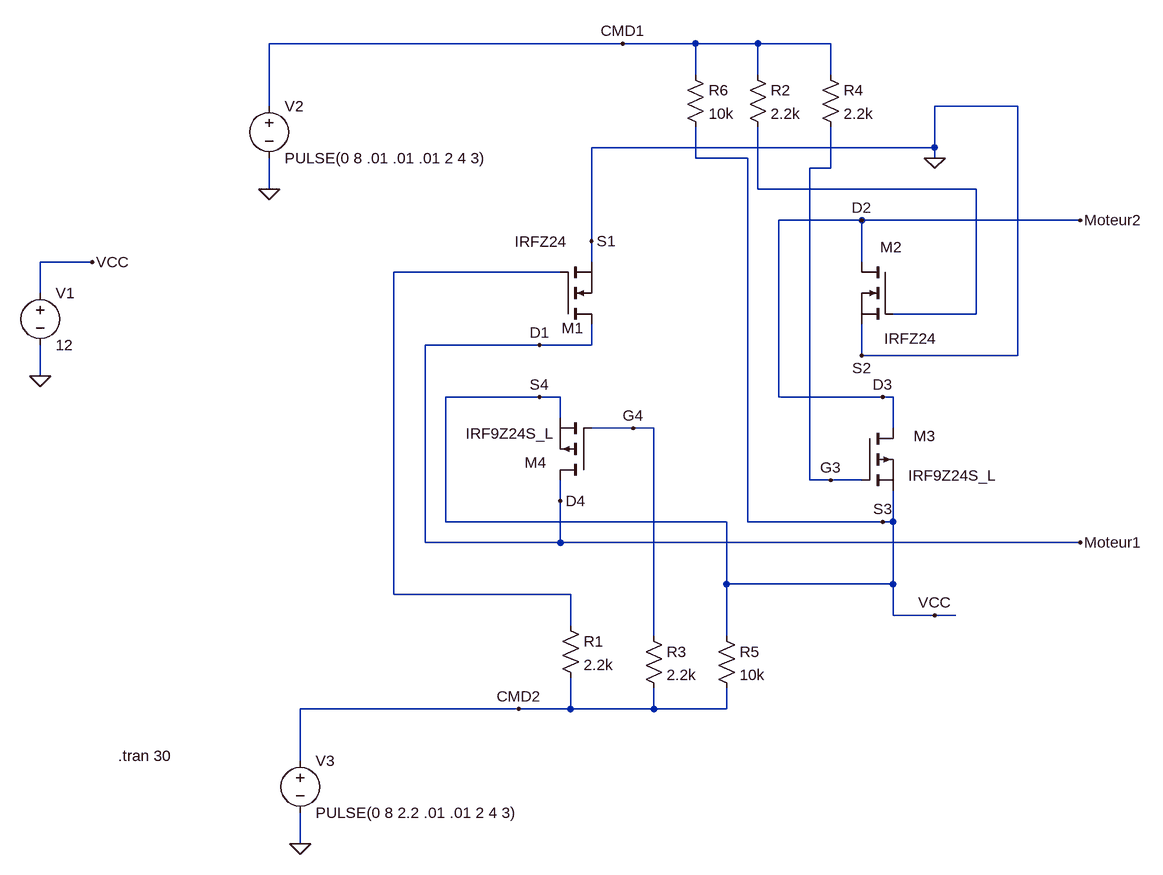
[diagram p0: schematic MOSFET-AT50-1.asc]
MOSFET-AT50-1.asc, the LTspice schematic file:
Version 4.1
SHEET 1 1300 708
WIRE 224 -544 -320 -544
WIRE 336 -544 224 -544
WIRE 432 -544 336 -544
WIRE 544 -544 432 -544
WIRE 336 -496 336 -544
WIRE 432 -496 432 -544
WIRE 544 -496 544 -544
WIRE -320 -448 -320 -544
WIRE 832 -448 704 -448
WIRE 704 -384 704 -448
WIRE 704 -384 176 -384
WIRE 336 -368 336 -416
WIRE 416 -368 336 -368
WIRE 704 -368 704 -384
WIRE 544 -352 544 -416
WIRE 544 -352 512 -352
WIRE -320 -320 -320 -368
WIRE 432 -320 432 -416
WIRE 768 -320 432 -320
WIRE 592 -272 464 -272
WIRE 928 -272 592 -272
WIRE 176 -240 176 -384
WIRE -592 -208 -672 -208
WIRE 176 -208 176 -240
WIRE 592 -208 592 -272
WIRE 128 -192 -128 -192
WIRE -672 -160 -672 -208
WIRE 768 -128 768 -320
WIRE 768 -128 640 -128
WIRE 96 -80 -80 -80
WIRE 176 -80 176 -112
WIRE 176 -80 96 -80
WIRE 592 -64 592 -112
WIRE 832 -64 832 -448
WIRE 832 -64 592 -64
WIRE -672 -32 -672 -80
WIRE 96 0 -48 0
WIRE 128 0 96 0
WIRE 464 0 464 -272
WIRE 624 0 464 0
WIRE 640 0 624 0
WIRE 128 32 128 0
WIRE 240 48 176 48
WIRE 272 48 240 48
WIRE 640 48 640 0
WIRE 512 128 512 -352
WIRE 544 128 512 128
WIRE 592 128 544 128
WIRE 128 160 128 128
WIRE -48 192 -48 0
WIRE 384 192 -48 192
WIRE 416 192 416 -368
WIRE 624 192 416 192
WIRE 640 192 640 144
WIRE 640 192 624 192
WIRE -80 224 -80 -80
WIRE 128 224 128 160
WIRE 128 224 -80 224
WIRE 928 224 128 224
WIRE 384 288 384 192
WIRE 640 288 640 192
WIRE 640 288 384 288
WIRE -128 304 -128 -192
WIRE 144 304 -128 304
WIRE 640 336 640 288
WIRE 704 336 640 336
WIRE 736 336 704 336
WIRE 144 352 144 304
WIRE 272 368 272 48
WIRE 384 368 384 288
WIRE 64 480 -272 480
WIRE 144 480 144 432
WIRE 144 480 64 480
WIRE 272 480 272 448
WIRE 272 480 144 480
WIRE 384 480 384 448
WIRE 384 480 272 480
WIRE -272 560 -272 480
WIRE -272 688 -272 640
FLAG 704 -368 0
FLAG 928 224 Moteur1
FLAG 928 -272 Moteur2
FLAG 64 480 CMD2
FLAG 224 -544 CMD1
FLAG 176 -240 S1
FLAG 592 -64 S2
FLAG 96 -80 D1
FLAG 592 -272 D2
FLAG 240 48 G4
FLAG 544 128 G3
FLAG 624 192 S3
FLAG 96 0 S4
FLAG 128 160 D4
FLAG 624 0 D3
FLAG 704 336 VCC
FLAG -672 -32 0
FLAG -592 -208 VCC
FLAG -320 -320 0
FLAG -272 688 0
SYMBOL nmos 128 -112 M180
WINDOW 0 2 -6 Left 2
WINDOW 3 -70 127 Left 2
SYMATTR InstName M1
SYMATTR Value IRFZ24
SYMBOL pmos 592 48 R0
WINDOW 0 80 12 Left 2
WINDOW 3 71 73 Left 2
SYMATTR InstName M3
SYMATTR Value IRF9Z24S_L
SYMBOL nmos 640 -208 M0
WINDOW 0 -14 -23 Left 2
WINDOW 3 -67 118 Left 2
SYMATTR InstName M2
SYMATTR Value IRFZ24
SYMBOL pmos 176 128 R180
WINDOW 0 69 27 Left 2
SYMATTR InstName M4
SYMATTR Value IRF9Z24S_L
SYMBOL res 128 336 R0
SYMATTR InstName R1
SYMATTR Value 2.2k
SYMBOL res 416 -512 R0
SYMATTR InstName R2
SYMATTR Value 2.2k
SYMBOL res 256 352 R0
SYMATTR InstName R3
SYMATTR Value 2.2k
SYMBOL res 528 -512 R0
SYMATTR InstName R4
SYMATTR Value 2.2k
SYMBOL res 368 352 R0
SYMATTR InstName R5
SYMATTR Value 10k
SYMBOL res 320 -512 R0
SYMATTR InstName R6
SYMATTR Value 10k
SYMBOL voltage -672 -176 R0
WINDOW 123 0 0 Left 0
WINDOW 39 0 0 Left 0
SYMATTR InstName V1
SYMATTR Value 12
SYMBOL voltage -320 -464 R0
WINDOW 123 0 0 Left 0
WINDOW 39 0 0 Left 0
SYMATTR InstName V2
SYMATTR Value PULSE(0 8 .01 .01 .01 2 4 3)
SYMBOL voltage -272 544 R0
WINDOW 123 0 0 Left 0
WINDOW 39 0 0 Left 0
SYMATTR InstName V3
SYMATTR Value PULSE(0 8 2.2 .01 .01 2 4 3)
TEXT -552 552 Left 2 !.tran 30

The netlist it stands for:
* MOSFET-AT50-1.asc
M1 D4 N002 0 0 IRFZ24
M3 D3 G3 VCC VCC IRF9Z24S_L
M2 D3 N001 0 0 IRFZ24
M4 D4 G4 VCC VCC IRF9Z24S_L
R1 N002 CMD2 2.2k
R2 CMD1 N001 2.2k
R3 G4 CMD2 2.2k
R4 CMD1 G3 2.2k
R5 VCC CMD2 10k
R6 CMD1 VCC 10k
V1 VCC 0 12
V2 CMD1 0 PULSE(0 8 .01 .01 .01 2 4 3)
V3 CMD2 0 PULSE(0 8 2.2 .01 .01 2 4 3)
.model NMOS NMOS
.model PMOS PMOS
.lib standard.mos
.tran 30
.backanno
.end